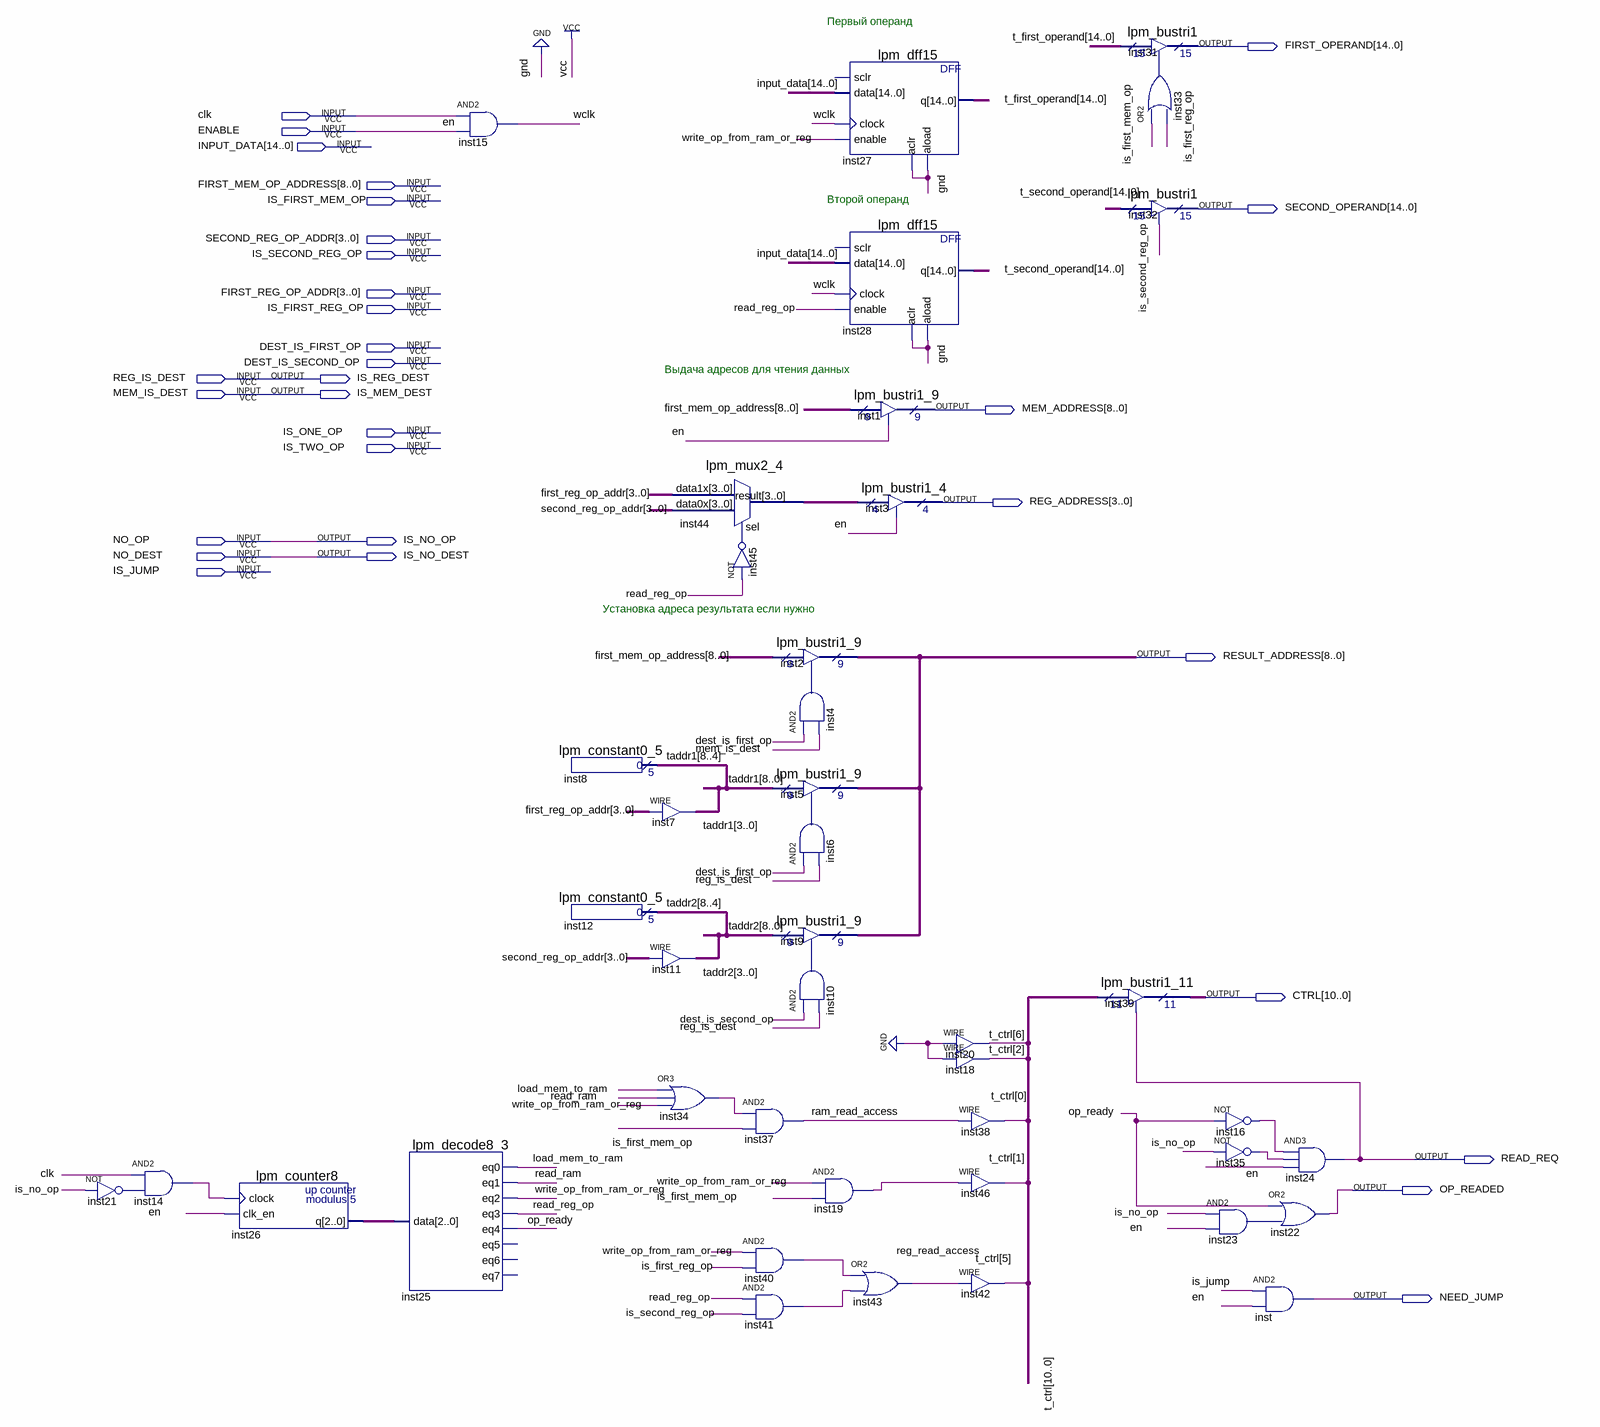
[diagram p0: schematic sheet]
// Quartus schematic OPERAND_READER.bdf as structural Verilog: 42 symbols, 31 pins
module OPERAND_READER (
  input  clk,
  input  ENABLE,
  input  [14:0] INPUT_DATA,
  input  [8:0] FIRST_MEM_OP_ADDRESS,
  input  IS_FIRST_MEM_OP,
  input  [3:0] SECOND_REG_OP_ADDR,
  input  IS_SECOND_REG_OP,
  input  [3:0] FIRST_REG_OP_ADDR,
  input  IS_FIRST_REG_OP,
  input  DEST_IS_FIRST_OP,
  input  DEST_IS_SECOND_OP,
  input  REG_IS_DEST,
  input  MEM_IS_DEST,
  input  IS_ONE_OP,
  input  IS_TWO_OP,
  input  NO_OP,
  input  NO_DEST,
  input  IS_JUMP,
  output [14:0] FIRST_OPERAND,
  output [14:0] SECOND_OPERAND,
  output IS_REG_DEST,
  output IS_MEM_DEST,
  output [8:0] MEM_ADDRESS,
  output [3:0] REG_ADDRESS,
  output IS_NO_OP,
  output IS_NO_DEST,
  output [8:0] RESULT_ADDRESS,
  output [10:0] CTRL,
  output READ_REQ,
  output OP_READED,
  output NEED_JUMP
);

  wire inst4_out, inst6_out, inst10_out, inst14_out, inst16_out, inst19_out, inst21_out, inst23_out,
       inst33_out, inst34_out, inst35_out, inst40_out, inst41_out, inst45_out, load_mem_to_ram, op_ready,
       ram_read_access, read_ram, read_reg_op, reg_read_access, wclk, write_op_from_ram_or_reg;
  wire [2:0] inst26_q;
  wire [3:0] inst44_result;
  wire [8:0] taddr1, taddr2;
  wire [10:0] t_ctrl;
  wire [14:0] t_first_operand, t_second_operand;

  not inst21 (inst21_out, NO_OP);
  and inst14 (inst14_out, clk, inst21_out);
  lpm_counter8 inst26 (.clock(inst14_out), .clk_en(ENABLE), .q(inst26_q));
  lpm_decode8_3 inst25 (
    .data(inst26_q), .eq0(load_mem_to_ram), .eq1(read_ram), .eq2(write_op_from_ram_or_reg),
    .eq3(read_reg_op), .eq4(op_ready));  // open: eq5, eq6, eq7
  and inst15 (wclk, clk, ENABLE);
  lpm_constant0_5 inst8 (.result(taddr1[8:4]));
  lpm_constant0_5 inst12 (.result(taddr2[8:4]));
  assign taddr1[3:0] = FIRST_REG_OP_ADDR;  // WIRE inst7
  assign taddr2[3:0] = SECOND_REG_OP_ADDR;  // WIRE inst11
  or inst34 (inst34_out, load_mem_to_ram, read_ram, write_op_from_ram_or_reg);
  lpm_mux2_4 inst44 (.data1x(FIRST_REG_OP_ADDR), .data0x(SECOND_REG_OP_ADDR), .sel(inst45_out), .result(inst44_result));
  not inst45 (inst45_out, read_reg_op);
  lpm_bustri1_9 inst2 (.enabledt(inst4_out), .data(FIRST_MEM_OP_ADDRESS), .tridata(RESULT_ADDRESS));
  and inst4 (inst4_out, DEST_IS_FIRST_OP, MEM_IS_DEST);
  lpm_bustri1_9 inst5 (.enabledt(inst6_out), .data(taddr1), .tridata(RESULT_ADDRESS));
  and inst6 (inst6_out, DEST_IS_FIRST_OP, REG_IS_DEST);
  lpm_bustri1_9 inst9 (.enabledt(inst10_out), .data(taddr2), .tridata(RESULT_ADDRESS));
  and inst10 (inst10_out, DEST_IS_SECOND_OP, REG_IS_DEST);
  and inst37 (ram_read_access, inst34_out, IS_FIRST_MEM_OP);
  and inst40 (inst40_out, write_op_from_ram_or_reg, IS_FIRST_REG_OP);
  and inst41 (inst41_out, read_reg_op, IS_SECOND_REG_OP);
  lpm_dff15 inst27 (
    .data(INPUT_DATA), .clock(wclk), .enable(write_op_from_ram_or_reg), .aclr(1'b0), .aload(1'b0),
    .q(t_first_operand));  // open: sclr
  lpm_dff15 inst28 (
    .data(INPUT_DATA), .clock(wclk), .enable(read_reg_op), .aclr(1'b0), .aload(1'b0), .q(t_second_operand));  // open: sclr
  lpm_bustri1_9 inst1 (.enabledt(ENABLE), .data(FIRST_MEM_OP_ADDRESS), .tridata(MEM_ADDRESS));
  and inst19 (inst19_out, write_op_from_ram_or_reg, IS_FIRST_MEM_OP);
  or inst43 (reg_read_access, inst40_out, inst41_out);
  lpm_bustri1_4 inst3 (.enabledt(ENABLE), .data(inst44_result), .tridata(REG_ADDRESS));
  assign t_ctrl[6] = 1'b0;  // WIRE inst20
  assign t_ctrl[2] = 1'b0;  // WIRE inst18
  assign t_ctrl[0] = ram_read_access;  // WIRE inst38
  assign t_ctrl[1] = inst19_out;  // WIRE inst46
  assign t_ctrl[5] = reg_read_access;  // WIRE inst42
  lpm_bustri1_11 inst39 (.enabledt(READ_REQ), .data(t_ctrl), .tridata(CTRL));
  lpm_bustri1 inst31 (.enabledt(inst33_out), .data(t_first_operand), .tridata(FIRST_OPERAND));
  or inst33 (inst33_out, IS_FIRST_MEM_OP, IS_FIRST_REG_OP);
  lpm_bustri1 inst32 (.enabledt(IS_SECOND_REG_OP), .data(t_second_operand), .tridata(SECOND_OPERAND));
  not inst16 (inst16_out, op_ready);
  not inst35 (inst35_out, NO_OP);
  and inst23 (inst23_out, NO_OP, ENABLE);
  and inst24 (READ_REQ, inst16_out, inst35_out, ENABLE);
  or inst22 (OP_READED, op_ready, inst23_out);
  and inst (NEED_JUMP, IS_JUMP, ENABLE);

  assign IS_MEM_DEST = MEM_IS_DEST;
  assign IS_NO_DEST = NO_DEST;
  assign IS_NO_OP = NO_OP;
  assign IS_REG_DEST = REG_IS_DEST;

  // Other names for the same wires on the sheet: en = ENABLE

  // Notes on the sheet:
  //   Первый операнд
  //   Второй операнд
  //   Выдача адресов для чтения данных
  //   Установка адреса результата если нужно
endmodule
